# EAGLE design Sensor PCB (EAGLE 7.6.0)
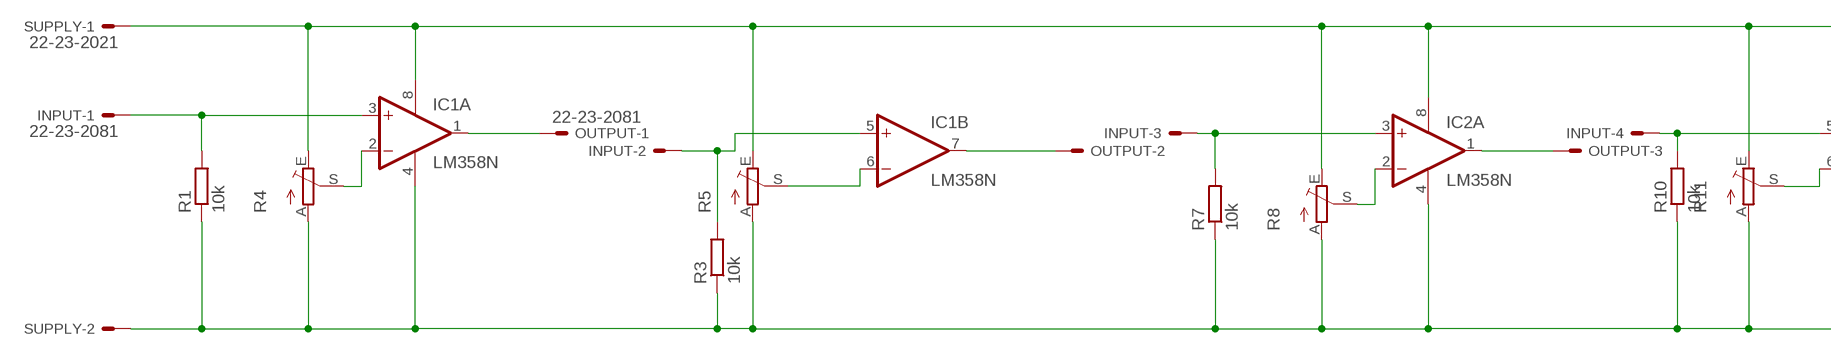
[diagram p0: schematic, sheet 1, part 1 of 2]
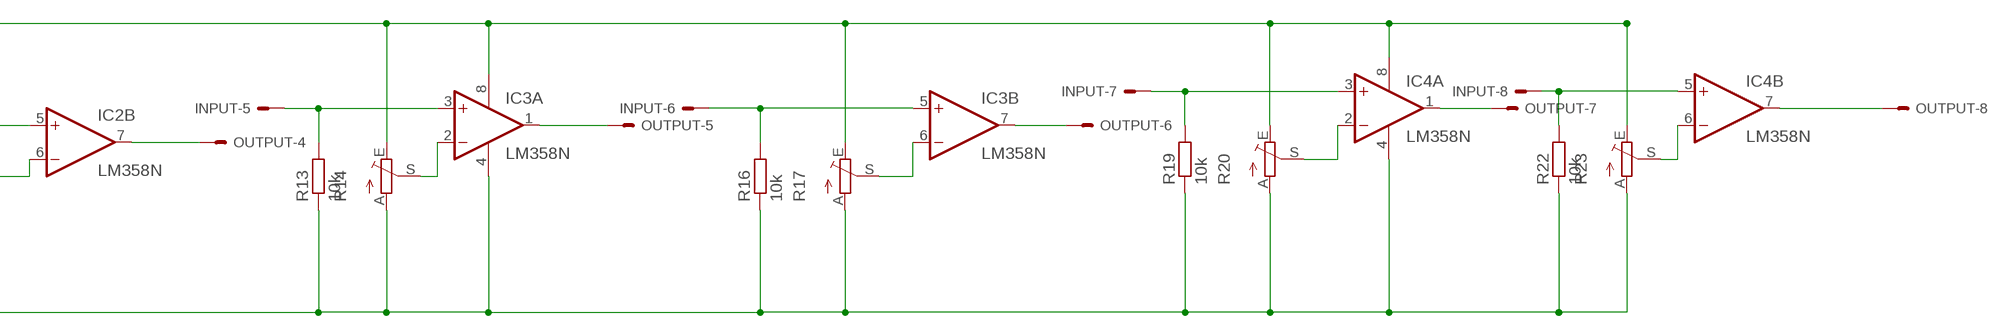
[diagram p1: schematic, sheet 1, part 2 of 2]

## Parts
IC1  LM358N  [DIL08]
IC2  LM358N  [DIL08]
IC3  LM358N  [DIL08]
IC4  LM358N  [DIL08]
INPUT  22-23-2081  [22-23-2081]
OUTPUT  22-23-2081  [22-23-2081]
R1  10k  R-EU_R1206  [R1206]
R3  10k  R-EU_R1206  [R1206]
R4  TRIM_EU-S64Y  [S64Y]
R5  TRIM_EU-S64Y  [S64Y]
R7  10k  R-EU_R1206  [R1206]
R8  TRIM_EU-S64Y  [S64Y]
R10  10k  R-EU_R1206  [R1206]
R11  TRIM_EU-S64Y  [S64Y]
R13  10k  R-EU_R1206  [R1206]
R14  TRIM_EU-S64Y  [S64Y]
R16  10k  R-EU_R1206  [R1206]
R17  TRIM_EU-S64Y  [S64Y]
R19  10k  R-EU_R1206  [R1206]
R20  TRIM_EU-S64Y  [S64Y]
R22  10k  R-EU_R1206  [R1206]
R23  TRIM_EU-S64Y  [S64Y]
SUPPLY  22-23-2021  [22-23-2021]

## Nets
N$1: IC1.3(A:+IN) INPUT.1 R1.2
N$2: IC1.2(A:-IN) R4.S
N$3: IC1.8(P:V+) IC2.8(P:V+) IC3.8(P:V+) IC4.8(P:V+) R4.E R5.E R8.E R11.E R14.E R17.E R20.E R23.E SUPPLY.1
N$4: IC1.4(P:V-) IC2.4(P:V-) IC3.4(P:V-) IC4.4(P:V-) R1.1 R3.1 R4.A R5.A R7.1 R8.A R10.1 R11.A R13.1 R14.A R16.1 R17.A R19.1 R20.A R22.1 R23.A SUPPLY.2
N$5: IC2.7(B:OUT) OUTPUT.4
N$6: IC1.1(A:OUT) OUTPUT.1
N$7: IC1.7(B:OUT) OUTPUT.2
N$9: IC1.5(B:+IN) INPUT.2 R3.2
N$10: IC1.6(B:-IN) R5.S
N$11: IC2.3(A:+IN) INPUT.3 R7.2
N$12: IC2.2(A:-IN) R8.S
N$13: IC2.1(A:OUT) OUTPUT.3
N$15: IC3.2(A:-IN) R14.S
N$16: IC2.5(B:+IN) INPUT.4 R10.2
N$17: IC3.6(B:-IN) R17.S
N$18: IC3.7(B:OUT) OUTPUT.6
N$19: IC2.6(B:-IN) R11.S
N$23: IC4.6(B:-IN) R23.S
N$24: IC3.3(A:+IN) INPUT.5 R13.2
N$25: IC3.1(A:OUT) OUTPUT.5
N$28: IC3.5(B:+IN) INPUT.6 R16.2
N$31: IC4.2(A:-IN) R20.S
N$32: IC4.3(A:+IN) INPUT.7 R19.2
N$33: IC4.1(A:OUT) OUTPUT.7
N$36: IC4.5(B:+IN) INPUT.8 R22.2
N$38: IC4.7(B:OUT) OUTPUT.8

## Library data of the parts
IC1-IC4 = linear:LM358: OP AMP also LM158; LM258; LM2904 Source: http://cache.national.com/ds/LM/LM158.pdf
INPUT OUTPUT = con-molex:22-23-2081: .100" (2.54mm) Center Header - 8 Pin; MF: MOLEX; MPN: 22-23-2081; OC_FARNELL: 1756826; OC_NEWARK: 01C7592
R1 R3 R7 R10 R13 R16 R19 R22 = resistor:R-EU_: RESISTOR, European symbol
R4 R5 R8 R11 R14 R17 R20 R23 = pot:TRIM_EU-: POTENTIOMETER
SUPPLY = con-molex:22-23-2021: .100" (2.54mm) Center Header - 2 Pin; MF: MOLEX; MPN: 22-23-2021; OC_FARNELL: 1462926; OC_NEWARK: 25C3832

## Board
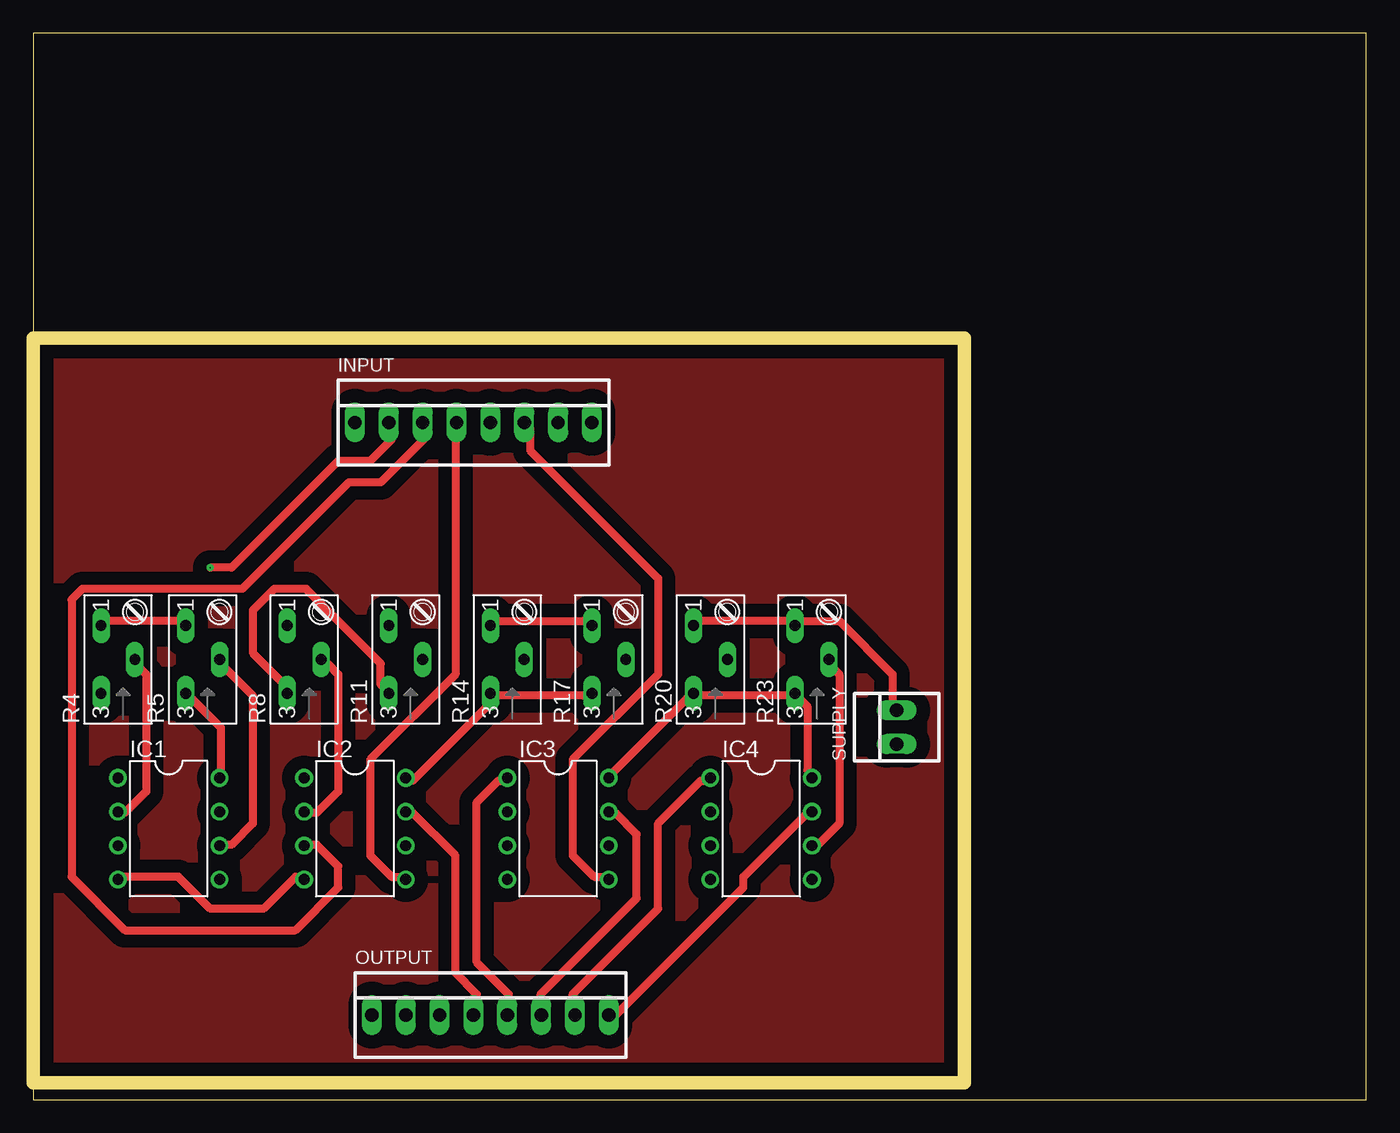
[diagram p2: board, top side]
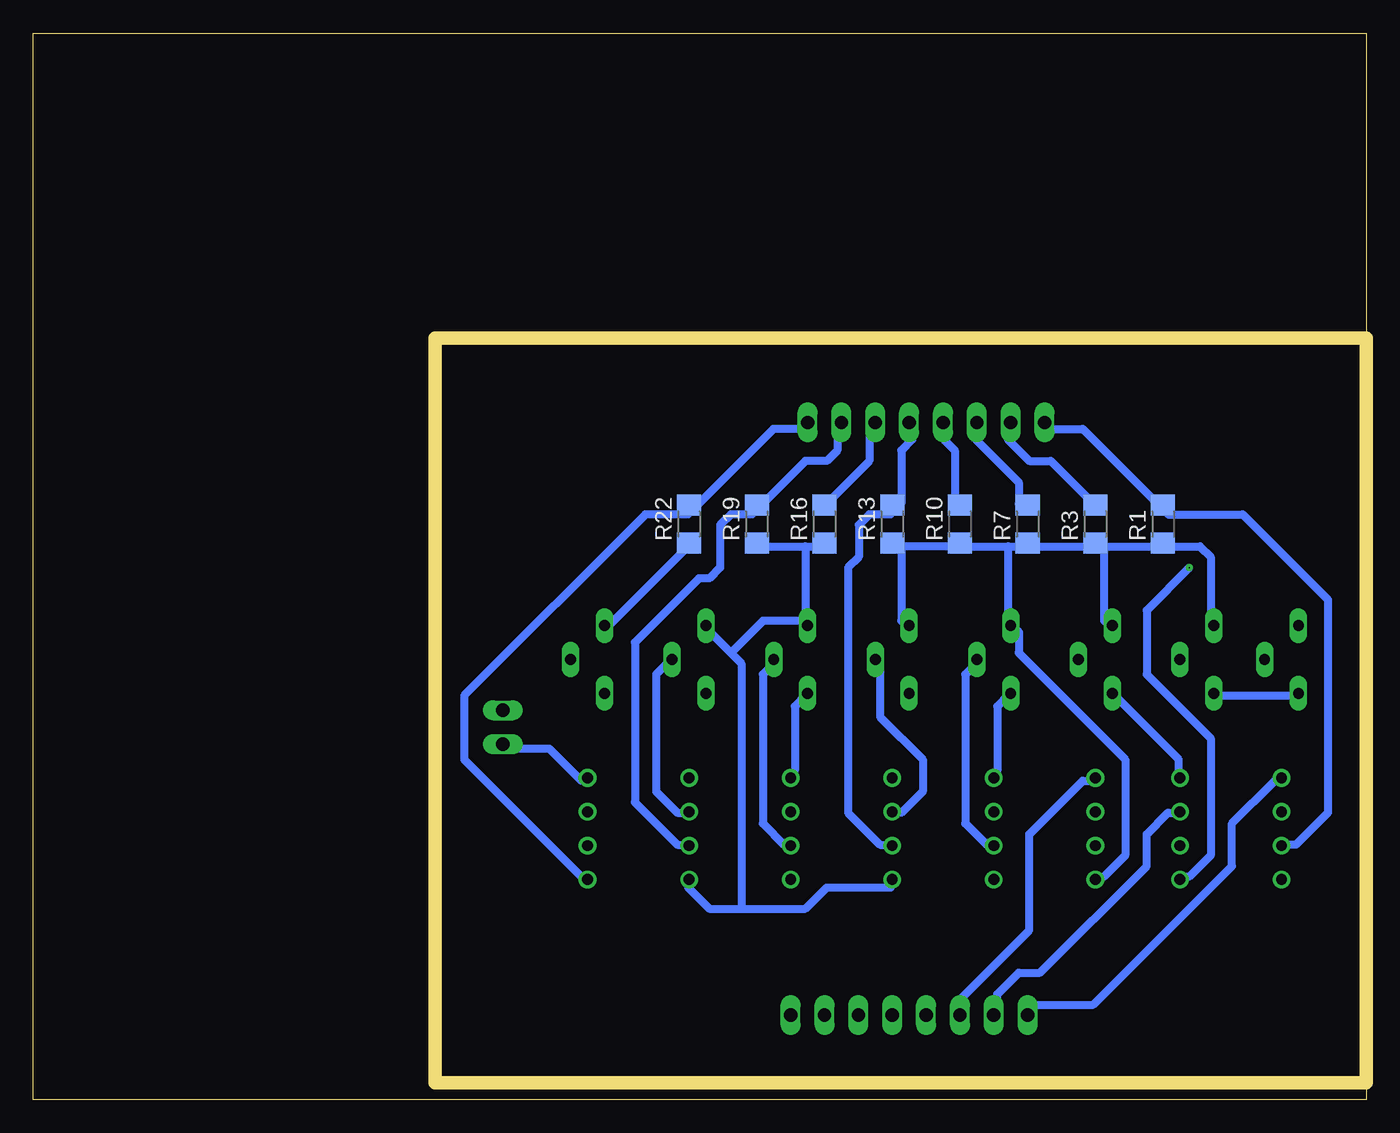
[diagram p3: board, bottom side, seen from below]

Size 100 x 80 mm. Coordinates in mm from the lower left corner, seen from the top.
Outline: 0,57.15 0,80 100,80 100,0 0,0 0,1.27
Outline: 0,57.15 69.85,57.15 69.85,1.27 0,1.27
Outline: 0,1.27 0,57.15
Copper layers (1*16): Top 0.035mm / dielectric 1.5mm / Bottom 0.035mm
Design rules "default *": minimum track width 0.6mm, minimum drill 0.1mm, track to track 1mm, track to pad 1mm, pad to pad 1mm, via to via 1mm, smd to smd 8mil, copper to edge 40mil, drill to drill 8mil, minimum pad ring 10mil, minimum via ring 8mil, stop-mask expansion 4mil, vias tented up to drill 0mil, thermal gap 10mil

### Footprints (pad centres in the part's own frame; a part is rotated, then mirrored left to right if it is on the bottom)
DIL08 = drill 0.813 pad 1.27: 1 -3.81,-3.81; 2 -1.27,-3.81; 3 1.27,-3.81; 4 3.81,-3.81; 5 3.81,3.81; 6 1.27,3.81; 7 -1.27,3.81; 8 -3.81,3.81
22-23-2081 = drill 1 long: 1 -8.89,0; 2 -6.35,0; 3 -3.81,0; 4 -1.27,0; 5 1.27,0; 6 3.81,0; 7 6.35,0; 8 8.89,0
R1206 = smd 1.6 x 1.803: 1 -1.422,0; 2 1.422,0
S64Y = drill 0.813 long: A 2.54,1.27; E -2.54,1.27; S 0,-1.27
22-23-2021 = drill 1 long: 1 -1.27,0; 2 1.27,0

### Placement (x,y rotation side)
IC1  10.16,20.32 270 top
IC2  24.13,20.32 270 top
IC3  39.37,20.32 270 top
IC4  54.61,20.32 270 top
INPUT  33.02,50.8 0 top
OUTPUT  34.29,6.35 0 top
R1  15.24,43.18 90 bottom
R3  20.32,43.18 90 bottom
R4  6.35,33.02 90 top
R5  12.7,33.02 90 top
R7  25.4,43.18 90 bottom
R8  20.32,33.02 90 top
R10  30.48,43.18 90 bottom
R11  27.94,33.02 90 top
R13  35.56,43.18 90 bottom
R14  35.56,33.02 90 top
R16  40.64,43.18 90 bottom
R17  43.18,33.02 90 top
R19  45.72,43.18 90 bottom
R20  50.8,33.02 90 top
R22  50.8,43.18 90 bottom
R23  58.42,33.02 90 top
SUPPLY  64.77,27.94 90 top

### Tracks (layer width: path | path; a pad name or v marks a point on that pad's centre or on a via)
N$1
  Bottom 0.6: INPUT.1 23.67,50.31 21.27,50.31 15.67,44.71 R1.2 14.87,43.91 9.27,43.91 2.87,37.51 2.87,21.51 5.27,19.11 6.07,19.11 IC1.3
N$2
  Top 0.6: IC1.2 6.87,21.51 8.47,23.11 8.47,31.91 7.67,32.71 R4.S
N$3
  Top 0.6: 57.27,30.31 50.07,30.31 R20.E 49.27,30.31 42.87,23.91 IC3.8 | 57.27,30.31 58.07,29.51 58.07,24.71 IC4.8 | 57.27,30.31 R23.E | IC1.8 14.07,24.71 14.07,27.91 11.67,30.31 R5.E | 34.87,30.31 41.27,30.31 R17.E | 34.87,30.31 28.47,23.91 IC2.8 | 34.87,30.31 R14.E | R8.E 18.87,31.11 16.47,33.51 16.47,36.71 18.07,38.31 20.47,38.31 26.07,32.71 26.07,31.11 R11.E
  Bottom 0.6: SUPPLY.1 64.47,26.31 61.27,26.31 58.87,23.91 IC4.8 | R4.E 5.27,30.31 10.87,30.31 R5.E | R8.E 18.87,30.31 14.07,25.51 14.07,24.71 IC1.8 | IC2.8 27.67,24.71 27.67,29.51 26.87,30.31 R11.E | IC3.8 42.87,24.71 42.87,29.51 42.07,30.31 R17.E
N$4
  Top 0.6: 57.27,35.91 50.07,35.91 R20.A | 57.27,35.91 60.47,35.91 64.47,31.91 64.47,29.51 SUPPLY.2 | 57.27,35.91 R23.A | R4.A 5.27,35.91 10.87,35.91 R5.A | IC1.4 6.87,16.71 10.87,16.71 13.27,14.31 17.27,14.31 19.67,16.71 IC2.4 | R17.A 41.27,35.91 34.87,35.91 R14.A
  Bottom 0.6: 46.87,14.31 49.27,14.31 50.87,15.91 IC4.4 | 46.87,14.31 42.07,14.31 40.47,15.91 35.67,15.91 IC3.4 | R22.1 50.87,41.51 57.27,35.11 R23.A | 46.87,14.31 46.87,32.71 47.67,33.51 | 47.67,33.51 49.27,35.11 R20.A | 19.67,41.51 15.67,41.51 R1.1 14.87,41.51 12.47,41.51 11.67,40.71 11.67,35.91 R5.A | 19.67,41.51 19.67,35.91 R8.A | 19.67,41.51 R3.1 20.47,41.51 25.27,41.51 R7.1 26.07,41.51 26.87,41.51 | 42.07,41.51 45.27,41.51 R19.1 | 42.07,41.51 41.27,41.51 R16.1 | 42.07,41.51 42.07,35.91 | 26.87,41.51 30.07,41.51 R10.1 30.87,41.51 34.87,41.51 | 26.87,41.51 26.87,35.91 R11.A 26.07,35.11 26.07,33.51 18.07,25.51 18.07,18.31 19.67,16.71 IC2.4 | 34.87,41.51 34.87,35.91 R14.A | 34.87,41.51 R13.1 | 47.67,33.51 45.27,35.91 42.07,35.91 | 42.07,35.91 R17.A
N$5
  Top 0.6: IC2.7 28.47,21.51 31.67,18.31 31.67,9.51 33.27,7.91 33.27,7.11 OUTPUT.4
N$6
  Bottom 0.6: IC1.1 6.87,23.91 10.07,20.71 10.07,17.51 20.47,7.11 25.27,7.11 OUTPUT.1
N$7
  Bottom 0.6: IC1.7 14.07,21.51 14.87,21.51 16.47,19.91 16.47,17.51 24.47,9.51 26.07,9.51 27.67,7.91 27.67,7.11 OUTPUT.2
N$8
  pour Top: 1.27,55.88 68.58,55.88 68.58,2.54 1.27,2.54
N$9  (via drill 0.1)
  Top 0.6: v13.27,39.91 14.87,39.91 22.87,47.91 25.27,47.91 26.87,49.51 26.87,50.31 INPUT.2
  Bottom 0.6: R3.2 20.47,44.71 23.67,47.91 25.27,47.91 26.87,49.51 26.87,50.31 INPUT.2 | v13.27,39.91 16.47,36.71 16.47,31.91 11.67,27.11 11.67,18.31 13.27,16.71 14.07,16.71 IC1.5
N$10
  Top 0.6: IC1.6 14.07,19.11 14.87,19.11 16.47,20.71 16.47,30.31 14.07,32.71 R5.S
N$11
  Top 0.6: IC2.3 20.47,19.11 21.27,19.11 22.87,17.51 22.87,15.91 19.67,12.71 6.87,12.71 2.87,16.71 2.87,37.51 3.67,38.31 15.67,38.31 23.67,46.31 26.07,46.31 29.27,49.51 29.27,50.31 INPUT.3
  Bottom 0.6: R7.2 26.07,44.71 26.07,46.31 29.27,49.51 29.27,50.31 INPUT.3
N$12
  Top 0.6: IC2.2 20.47,21.51 21.27,21.51 22.87,23.11 22.87,31.91 22.07,32.71 R8.S
N$13
  Bottom 0.6: IC2.1 20.47,23.91 21.27,23.91 25.27,19.91 25.27,12.71 30.87,7.11 OUTPUT.3
N$15
  Bottom 0.6: IC3.2 35.67,21.51 34.87,21.51 33.27,23.11 33.27,25.51 36.47,28.71 36.47,32.71 R14.S
N$16
  Top 0.6: IC2.5 27.67,16.71 26.87,16.71 25.27,18.31 25.27,25.51 31.67,31.91 31.67,50.31 INPUT.4
  Bottom 0.6: R10.2 30.87,44.71 30.87,48.71 31.67,49.51 31.67,50.31 INPUT.4
N$17
  Bottom 0.6: IC3.6 43.67,19.11 45.27,20.71 45.27,31.91 44.47,32.71 R17.S
N$18
  Top 0.6: IC3.7 43.67,21.51 45.27,19.91 45.27,15.11 38.07,7.91 38.07,7.11 OUTPUT.6
N$19
  Bottom 0.6: IC2.6 28.47,19.11 30.07,20.71 30.07,31.91 29.27,32.71 R11.S
N$23
  Top 0.6: IC4.6 58.87,19.11 60.47,20.71 60.47,31.91 59.67,32.71 R23.S
N$24
  Bottom 0.6: INPUT.5 34.07,50.31 34.07,49.51 34.87,48.71 34.87,44.71 R13.2 35.67,43.91 37.27,43.91 38.07,43.11 38.07,40.71 38.87,39.91 38.87,21.51 36.47,19.11 35.67,19.11 IC3.3
N$25
  Top 0.6: IC3.1 35.67,23.91 34.87,23.91 33.27,22.31 33.27,10.31 35.67,7.91 35.67,7.11 OUTPUT.5
N$28
  Top 0.6: IC3.5 42.87,16.71 42.07,16.71 40.47,18.31 40.47,25.51 46.87,31.91 46.87,39.11 37.27,48.71 37.27,50.31 INPUT.6
  Bottom 0.6: R16.2 40.47,44.71 37.27,47.91 37.27,50.31 INPUT.6
N$31
  Bottom 0.6: IC4.2 50.87,21.51 51.67,21.51 53.27,23.11 53.27,31.91 52.47,32.71 R20.S
N$32
  Bottom 0.6: INPUT.7 39.67,50.31 39.67,48.71 40.47,47.91 42.07,47.91 45.27,44.71 R19.2 46.07,43.91 47.67,43.91 48.47,43.11 48.47,39.91 49.27,39.11 50.07,39.11 54.87,34.31 54.87,22.31 51.67,19.11 50.87,19.11 IC4.3
N$33
  Top 0.6: IC4.1 50.87,23.91 50.07,23.91 46.87,20.71 46.87,14.31 40.47,7.91 40.47,7.11 OUTPUT.7
N$36
  Bottom 0.6: INPUT.8 42.07,50.31 44.47,50.31 50.07,44.71 R22.2 50.87,43.91 54.07,43.91 67.67,30.31 67.67,25.51 58.87,16.71 IC4.5
N$38
  Top 0.6: IC4.7 58.07,21.51 53.27,16.71 53.27,15.91 43.67,6.31 OUTPUT.8